# Altium project GameBoard_V1I1.PrjPcb (part 18 of 20)

## Sheet [28] - PWR 1V375 OPT, 3V3 OPT.SchDoc
size A2; DocumentNumber: 27; SheetNumber: 27; SheetTotal: 32
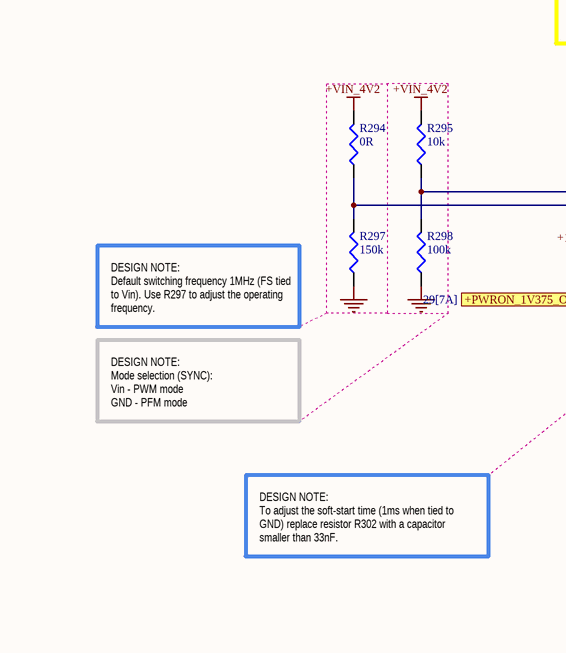
[diagram p88: [28] - PWR 1V375 OPT, 3V3 OPT.SchDoc, top left]
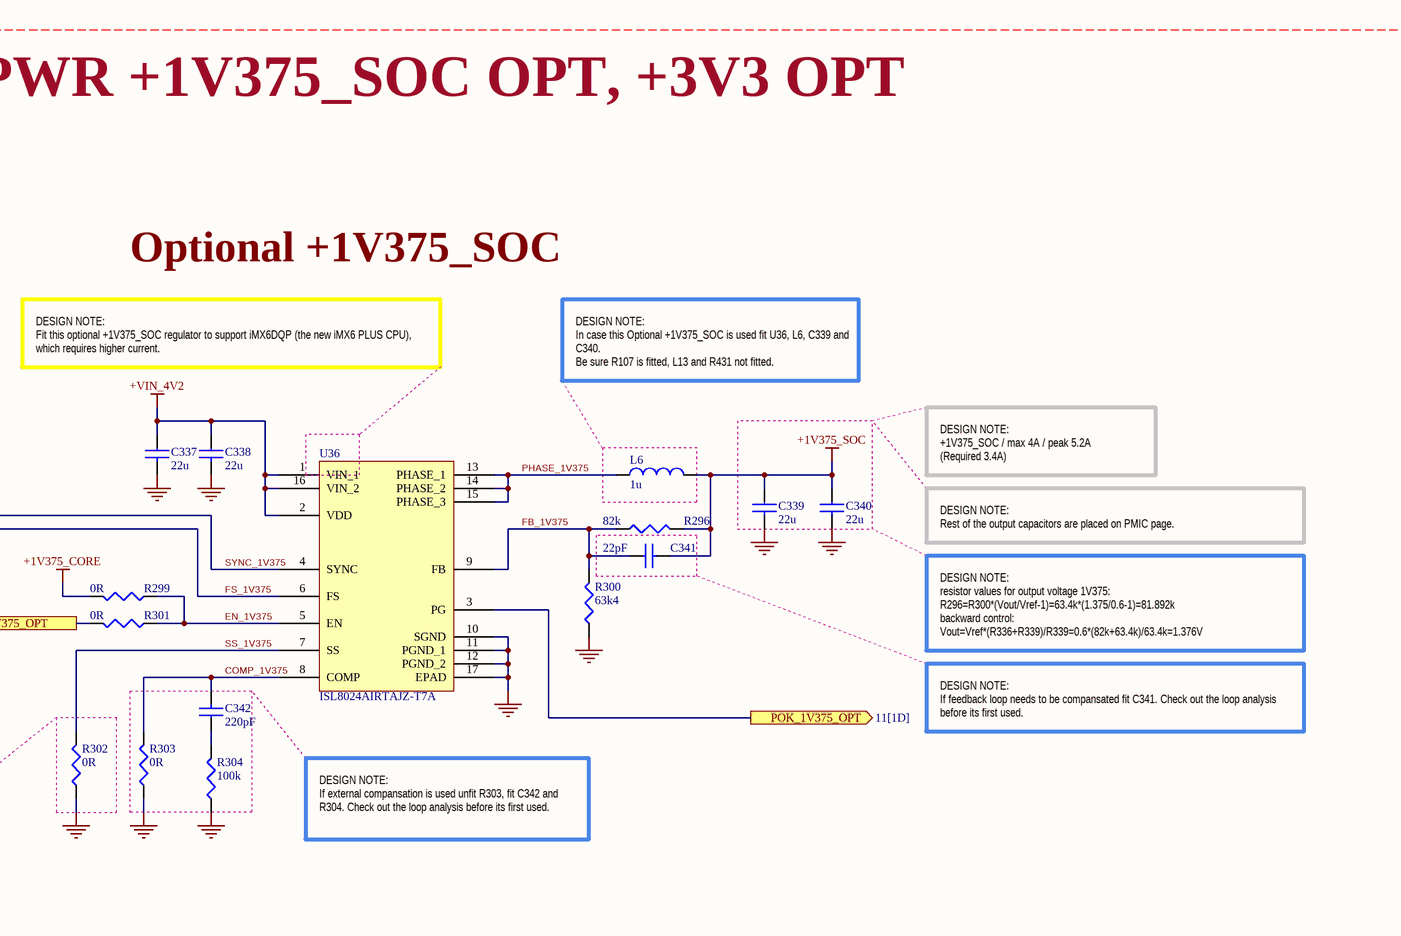
[diagram p89: [28] - PWR 1V375 OPT, 3V3 OPT.SchDoc, top right]
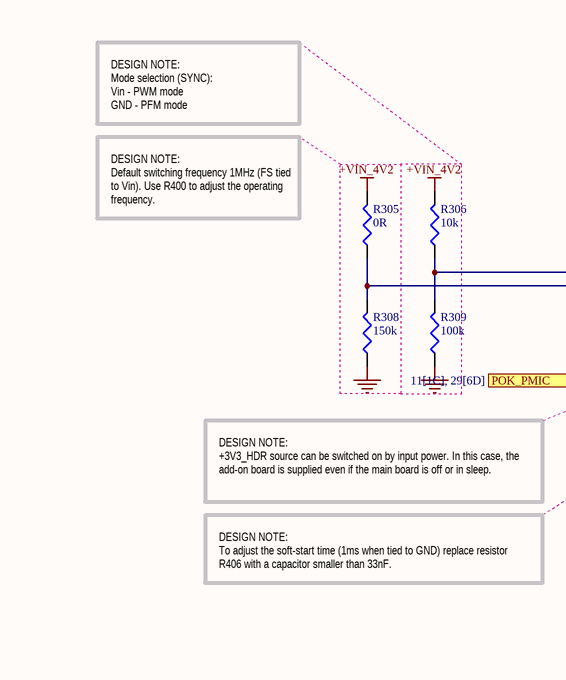
[diagram p90: [28] - PWR 1V375 OPT, 3V3 OPT.SchDoc, bottom left]
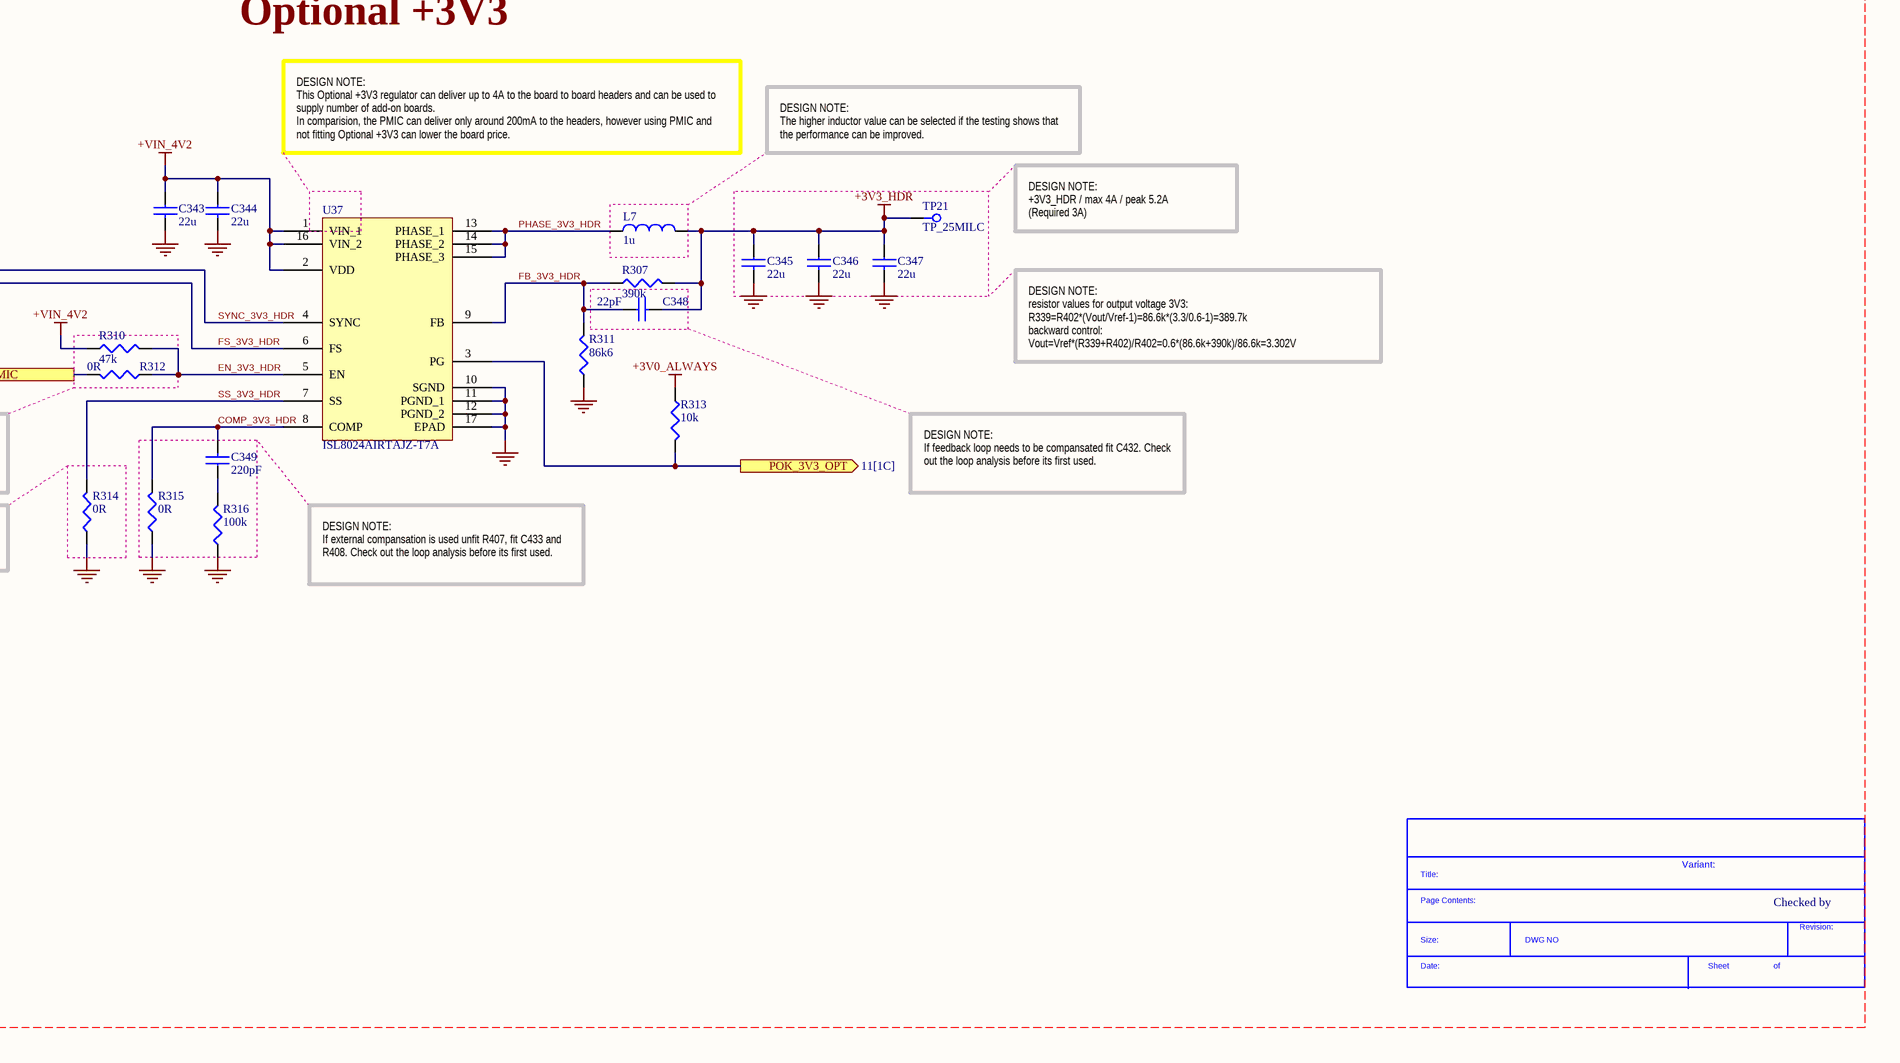
[diagram p91: [28] - PWR 1V375 OPT, 3V3 OPT.SchDoc, bottom right]

### Parts
(Parts that share a designator on the sheet are numbered #1, #2 ... from top to bottom, then left to right.)
*#32  SDTitleBlock  (value not drawn)  (graphical)
C337  22u  [C0603]
C338  22u  [C0603]
C339  22u  [C0603]
C340  22u  [C0603]
C341  22pF  [C0402]
C342  220pF  [C0402]
C343  22u  [C0603]
C344  22u  [C0603]
C345  22u  [C0603]
C346  22u  [C0603]
C347  22u  [C0603]
C348  22pF  [C0402]
C349  220pF  [C0402]
L6  1u  [IHLP_204MILX216MIL]
L7  1u  [IHLP_204MILX216MIL]
R294  0R  [R0402]
R295  10k  [R0402]
R296  82k  [R0402]
R297  150k  [R0402]
R298  100k  [R0402]
R299  0R  [R0402]
R300  63k4  [R0402]
R301  0R  [R0402]
R302  0R  [R0402]
R303  0R  [R0402]
R304  100k  [R0402]
R305  0R  [R0402]
R306  10k  [R0402]
R307  390k  [R0402]
R308  150k  [R0402]
R309  100k  [R0402]
R310  47k  [R0402]
R311  86k6  [R0402]
R312  0R  [R0402]
R313  10k  [R0402]
R314  0R  [R0402]
R315  0R  [R0402]
R316  100k  [R0402]
TP21  TP_25MILC  [TP_25C]  (no BOM)
U36  ISL8024AIRTAJZ-T7A  [16-TQFN_3mmx3mm_V1.1]
U37  ISL8024AIRTAJZ-T7A  [16-TQFN_3mmx3mm_V1.1]

### Ports
+PWRON_1V375_OPT (see 29[7A]), POK_1V375_OPT (out, see 11[1D]), POK_3V3_OPT (out, see 11[1C]), POK_PMIC (see 11[1C], 29[6D])

### Nets
+1V375_CORE: R299.2
+1V375_SOC: C339.1 C340.1 C341.2 L6.2 R296.2
+3V0_ALWAYS: R313.1
+3V3_HDR: C345.1 C346.1 C347.1 C348.2 L7.2 R307.2 TP21.1
+VIN_4V2: C337.1 C338.1 C343.1 C344.1 R294.2 R295.2 R305.2 R306.2 R310.1 U36.1(VIN_1) U36.2(VDD) U36.16(VIN_2) U37.1(VIN_1) U37.2(VDD) U37.16(VIN_2)
GND: C337.2 C338.2 C339.2 C340.2 C343.2 C344.2 C345.2 C346.2 C347.2 R297.1 R298.1 R300.1 R302.1 R303.1 R304.1 R308.1 R309.1 R311.1 R314.1 R315.1 R316.1 U36.10(SGND) U36.11(PGND_1) U36.12(PGND_2) U36.17(EPAD) U37.10(SGND) U37.11(PGND_1) U37.12(PGND_2) U37.17(EPAD)
+PWRON_1V375_OPT: R301.2 ; port +PWRON_1V375_OPT
COMP_1V375: C342.2 R303.2 U36.8(COMP)
COMP_3V3_HDR: C349.2 R315.2 U37.8(COMP)
EN_1V375: R299.1 R301.1 U36.5(EN)
EN_3V3_HDR: R310.2 R312.1 U37.5(EN)
FB_1V375: C341.1 R296.1 R300.2 U36.9(FB)
FB_3V3_HDR: C348.1 R307.1 R311.2 U37.9(FB)
FS_1V375: R294.1 R297.2 U36.6(FS)
FS_3V3_HDR: R305.1 R308.2 U37.6(FS)
PHASE_1V375: L6.1 U36.13(PHASE_1) U36.14(PHASE_2) U36.15(PHASE_3)
PHASE_3V3_HDR: L7.1 U37.13(PHASE_1) U37.14(PHASE_2) U37.15(PHASE_3)
POK_1V375_OPT: U36.3(PG) ; port POK_1V375_OPT
POK_3V3_OPT: R313.2 U37.3(PG) ; port POK_3V3_OPT
POK_PMIC: R312.2 ; port POK_PMIC
SS_1V375: R302.2 U36.7(SS)
SS_3V3_HDR: R314.2 U37.7(SS)
SYNC_1V375: R295.1 R298.2 U36.4(SYNC)
SYNC_3V3_HDR: R306.1 R309.2 U37.4(SYNC)
NetC342_1: C342.1 R304.2
NetC349_1: C349.1 R316.2

### Layout directives
net class [27] - PWR 1V375 OPT/3V3 OPT: +1V375_CORE, +1V375_SOC, +3V0_ALWAYS, +3V3_HDR, +VIN_4V2, COMP_1V375, COMP_3V3_HDR, EN_1V375, EN_3V3_HDR, FB_1V375, FB_3V3_HDR, FS_1V375, FS_3V3_HDR, GND, PHASE_1V375, PHASE_3V3_HDR, SS_1V375, SS_3V3_HDR, SYNC_1V375, SYNC_3V3_HDR

### Notes on the sheet
- PWR +1V375_SOC OPT, +3V3 OPT
- Optional +1V375_SOC
- DESIGN NOTE:
  Fit this optional +1V375_SOC regulator to support iMX6DQP (the new iMX6 PLUS CPU), which requires higher current.
- DESIGN NOTE:
  In case this Optional +1V375_SOC is used fit U36, L6, C339 and C340.
  Be sure R107 is fitted, L13 and R431 not fitted.
- DESIGN NOTE:
  +1V375_SOC / max 4A / peak 5.2A
  (Required 3.4A)
- DESIGN NOTE:
  Rest of the output capacitors are placed on PMIC page.
- DESIGN NOTE:
  Default switching frequency 1MHz (FS tied to Vin). Use R297 to adjust the operating frequency.
- DESIGN NOTE:
  resistor values for output voltage 1V375:
  R296=R300*(Vout/Vref-1)=63.4k*(1.375/0.6-1)=81.892k
  backward control:
  Vout=Vref*(R336+R339)/R339=0.6*(82k+63.4k)/63.4k=1.376V
- DESIGN NOTE:
  Mode selection (SYNC):
  Vin - PWM mode
  GND - PFM mode
- DESIGN NOTE:
  If feedback loop needs to be compansated fit C341. Check out the loop analysis before its first used.
- DESIGN NOTE:
  If external compansation is used unfit R303, fit C342 and R304. Check out the loop analysis before its first used.
- DESIGN NOTE:
  To adjust the soft-start time (1ms when tied to GND) replace resistor R302 with a capacitor smaller than 33nF.
- Optional +3V3
- DESIGN NOTE:
  This Optional +3V3 regulator can deliver up to 4A to the board to board headers and can be used to supply number of add-on boards.
  In comparision, the PMIC can deliver only around 200mA to the headers, however using PMIC and not fitting Optional +3V3 can lower the board price.
- DESIGN NOTE:
  The higher inductor value can be selected if the testing shows that the performance can be improved.
- DESIGN NOTE:
  Default switching frequency 1MHz (FS tied to Vin). Use R400 to adjust the operating frequency.
- DESIGN NOTE:
  +3V3_HDR / max 4A / peak 5.2A
  (Required 3A)
- DESIGN NOTE:
  resistor values for output voltage 3V3:
  R339=R402*(Vout/Vref-1)=86.6k*(3.3/0.6-1)=389.7k
  backward control:
  Vout=Vref*(R339+R402)/R402=0.6*(86.6k+390k)/86.6k=3.302V
- DESIGN NOTE:
  +3V3_HDR source can be switched on by input power. In this case, the add-on board is supplied even if the main board is off or in sleep.
- DESIGN NOTE:
  If feedback loop needs to be compansated fit C432. Check out the loop analysis before its first used.
- DESIGN NOTE:
  To adjust the soft-start time (1ms when tied to GND) replace resistor R406 with a capacitor smaller than 33nF.
- DESIGN NOTE:
  If external compansation is used unfit R407, fit C433 and R408. Check out the loop analysis before its first used.
- Variant:
- Checked by
- (in symbol SDTitleBlock) Title:; Page Contents:; Revision:; Size:; DWG NO; Date:; Sheet; of

### Library data of the parts
C337 C338 C343 C344 = C1608X5R0J226M080AC: CAP CER 22UF 6.3V 20% X5R 0603; Manufacturer: TDK Corporation; Capacitance: 22µF; .Creator: MM; .Checked PCB: used; Supplier 1: Digi-Key; Manufacturer Part Number: C1608X5R0J226M080AC; RoHS: RoHS Compliant; Category: Capacitors; Stock 1: 593047; Pricing 1: 1=0.39, 10=0.343, 100=0.1714, 250=0.13708, 500=0.12484, 1000=0.1104 (USD); Packaging: Cut Tape (CT); Tolerance: ±20%; Voltage - Rated: 6.3V; Temperature Coefficient: X5R; Mounting Type: Surface Mount, MLCC; Operating Temperature: -55°C ~ 85°C; Applications: General Purpose; Ratings: -; Package / Case: 0603 (1608 Metric); Size / Dimension: 0.063" L x 0.031" W (1.60mm x 0.80mm); Height - Seated (Max): -; Thickness (Max): 0.039" (1.00mm); Lead Spacing: -; Features: -; Lead Style: -; ComponentLink1URL: http://product.tdk.com/en/catalog/datasheets/mlcc_commercial_general_en.pdf; ComponentLink1Description: http://product.tdk.com/en/catalog/datasheets/mlcc_commercial_general_en.pdf; Supplier Part Number 1: 445-8028-1-ND; .Checked SCH: used
C339 C340 C345-C347 = GRM188R60G226MEA0L: CAP CER 22UF 4V 20% X5R 0603; Manufacturer: Murata Electronics North America; Capacitance: 22µF; .Checked PCB: used; .Creator: MM; Supplier 1: Digi-Key; Supplier Part Number 1: 490-5526-1-ND; Manufacturer Part Number: GRM188R60G226MEA0L; RoHS: RoHS Compliant; Category: Capacitors; Stock 1: 5760; Pricing 1: 1=0.79, 10=0.663, 50=0.4752, 100=0.4158, 250=0.32672, 500=0.297, 1000=0.2376 (USD); Voltage - Rated: 4V; Tolerance: ±20%; Temperature Coefficient: X5R; Mounting Type: Surface Mount, MLCC; Operating Temperature: -55°C ~ 85°C; Applications: General Purpose; Ratings: -; Package / Case: 0603 (1608 Metric); Size / Dimension: 0.063" L x 0.031" W (1.60mm x 0.80mm); Height - Seated (Max): -; Thickness (Max): 0.035" (0.90mm); Lead Spacing: -; Features: -; Packaging: Cut Tape (CT); Lead Style: -; ComponentLink1URL: http://www.murata.com/products/catalog/pdf/c02e.pdf; ComponentLink1Description: http://www.murata.com/products/catalog/pdf/c02e.pdf; .Checked SCH: used
C341 C348 = C1005C0G1H220J: CAP CER 22PF 50V C0G 5% 0402; Manufacturer: TDK Corporation; .Checked PCB: used; Temperature Coefficient: C0G, NP0; Capacitance: 22pF; Category: Capacitors; Supplier Part Number: 445-1239-1-ND; Manufacturer Part Number: C1005C0G1H220J; Operating Temperature: -55°C ~ 125°C; Package / Case: 0402 (1005 Metric); Price 1k [$]: 0.00442; Value: 22pF; .Checked SCH: used; Voltage - Rated: 50V; Supplier: Digikey; Supplier 1: Digi-Key; Supplier Part Number 1: 445-1239-1-ND; RoHS: RoHS Compliant; Stock 1: 176261; Pricing 1: 1=0.08, 10=0.05, 100=0.018, 250=0.013, 500=0.0096, 1000=0.0065 (USD); Tolerance: ±5%; Mounting Type: Surface Mount, MLCC; Applications: General Purpose; Ratings: -; Size / Dimension: 0.039" L x 0.020" W (1.00mm x 0.50mm); Height - Seated (Max): -; Thickness (Max): 0.022" (0.55mm); Lead Spacing: -; Features: -; Packaging: Cut Tape (CT); Lead Style: -; ComponentLink1URL: http://www.tdk.co.jp/tefe02/e412_c.pdf; ComponentLink1Description: http://www.tdk.co.jp/tefe02/e412_c.pdf
C342 C349 = C1005X7R1H221K: CAP CER 220PF 50V X7R 10% 0402; Manufacturer: TDK Corporation; .Checked PCB: used; Capacitance: 220pF; Category: Capacitors; Supplier Part Number: 445-1254-1-ND; Manufacturer Part Number: C1005X7R1H221K; Operating Temperature: -55°C ~ 125°C; Package / Case: 0402 (1005 Metric); Price 1k [$]: 0.00650; Value: 220pF; .Checked SCH: used; Voltage - Rated: 50V; Supplier: Digikey; Supplier 1: Digi-Key; Supplier Part Number 1: 445-1254-1-ND; RoHS: RoHS Compliant; Stock 1: 212041; Pricing 1: 1=0.08, 10=0.05, 100=0.018, 250=0.013, 500=0.0096, 1000=0.0065 (USD); Tolerance: ±10%; Temperature Coefficient: X7R; Mounting Type: Surface Mount, MLCC; Applications: General Purpose; Ratings: -; Size / Dimension: 0.039" L x 0.020" W (1.00mm x 0.50mm); Height - Seated (Max): -; Thickness (Max): 0.022" (0.55mm); Lead Spacing: -; Features: -; Packaging: Cut Tape (CT); Lead Style: -; ComponentLink1URL: http://www.tdk.co.jp/tefe02/e412_c.pdf; ComponentLink1Description: http://www.tdk.co.jp/tefe02/e412_c.pdf; Supplier 2: Digi-Key; Supplier Part Number 2: 399-14273-1-ND
L6 L7 = IHLP2020BZER1R0M11: as L17 on sheet [31] - PWR BATTERY CHARGER; Supplier 1: Digi-Key; Manufacturer Part Number: IHLP2020BZER1R0M11; RoHS: RoHS Compliant; Category: Inductors, Coils, Chokes; Stock 1: 8442; Pricing 1: 1=2.4, 10=2.24, 100=1.664, 500=1.408, 1000=1.312 (USD); Packaging: Cut Tape (CT); Material - Core: -; Current Rating: 7.5A; Q @ Freq: -; Operating Temperature: -55°C ~ 125°C; Mounting Type: Surface Mount; Package / Case: Non Standard; Size / Dimension: 0.216" L x 0.204" W (5.49mm x 5.18mm); Height - Seated (Max): 0.079" (2.00mm); Supplier Device Package: -; Supplier Part Number 1: 541-1218-1-ND; .Checked SCH: used
R294 R299 R301-R303 R305 R312 R314 R315 = RC0402JR-070RL: as R465-R469 on sheet [31] - PWR BATTERY CHARGER; Category: Resistors; Supplier Part Number: 311-0.0JRCT-ND; Manufacturer Part Number: RC0402JR-070RL; Package / Case: 0402 (1005 Metric); Price 1k [$]: 0.01389; Value: 0R; .Checked SCH: used; Supplier: Digikey; Supplier 1: Digi-Key; Supplier Part Number 1: 311-0.0JRCT-ND; RoHS: RoHS Compliant; Stock 1: 1106330; Pricing 1: 10=0.012, 50=0.009, 100=0.0069, 250=0.00512, 500=0.0038, 1000=0.00253 (USD); Composition: Thick Film; Features: -; Temperature Coefficient: -; Size / Dimension: 0.039" L x 0.020" W (1.00mm x 0.50mm); Height: 0.016" (0.40mm); Number of Terminations: 2; Packaging: Cut Tape (CT); ComponentLink1URL: http://www.yageo.com/documents/recent/PYu-RC0402_51_RoHS_L_6.pdf; ComponentLink1Description: http://www.yageo.com/documents/recent/PYu-RC0402_51_RoHS_L_6.pdf
R295 R306 R313 = RC0402FR-0710KL: as R478 on sheet [31] - PWR BATTERY CHARGER; Category: Resistors; Supplier Part Number: 311-10.0KLRCT-ND; Manufacturer Part Number: RC0402FR-0710KL; Package / Case: 0402 (1005 Metric); Price 1k [$]: 0.01421; Resistance (Ohms): 10K; Tolerance: ±1%; Value: 10k; .Checked SCH: used; Supplier: Digikey; Supplier 1: Digi-Key; Supplier Part Number 1: 311-10.0KLRCT-ND; RoHS: RoHS Compliant; Stock 1: 2916495; Pricing 1: 10=0.014, 50=0.0104, 100=0.0079, 250=0.00584, 500=0.00432, 1000=0.00288 (USD); Composition: Thick Film; Features: -; Size / Dimension: 0.039" L x 0.020" W (1.00mm x 0.50mm); Height: 0.016" (0.40mm); Number of Terminations: 2; Packaging: Cut Tape (CT); ComponentLink1URL: http://www.yageo.com/documents/recent/PYu-RC0402_51_RoHS_L_6.pdf; ComponentLink1Description: http://www.yageo.com/documents/recent/PYu-RC0402_51_RoHS_L_6.pdf
R296 = RC0402FR-0782KL: RES 82.0K OHM 1/16W 1% 0402 SMD; Manufacturer: Yageo; Power (Watts): 0.063W, 1/16W; Temperature Coefficient: ±100ppm/°C; .Creator: MM; .Checked PCB: used; Supplier 1: Digi-Key; Manufacturer Part Number: RC0402FR-0782KL; RoHS: RoHS Compliant; Category: Resistors; Stock 1: 338; Pricing 1: 1=0.1, 10=0.015, 25=0.0108, 100=0.006, 250=0.00456, 500=0.00364, 1000=0.00268, 2500=0.00233, 5000=0.00192 (USD); Packaging: Cut Tape (CT); Resistance (Ohms): 82k; Tolerance: ±1%; Composition: Thick Film; Features: Moisture Resistant; Package / Case: 0402 (1005 Metric); Supplier Device Package: 0402; Size / Dimension: 0.039" L x 0.020" W (1.00mm x 0.50mm); Height: 0.016" (0.40mm); Number of Terminations: 2; ComponentLink1URL: http://www.yageo.com/documents/recent/PYu-RC0402_51_RoHS_L_6.pdf; ComponentLink1Description: http://www.yageo.com/documents/recent/PYu-RC0402_51_RoHS_L_6.pdf; Supplier Part Number 1: 311-82.0KLRCT-ND; .Checked SCH: used
R297 R308 = RC0402FR-07150KL: RES 150K OHM 1/16W 1% 0402 SMD; Manufacturer: Yageo; Power (Watts): 0.063W, 1/16W; Temperature Coefficient: ±100ppm/°C; .Creator: MM; .Checked PCB: used; Supplier 1: Digi-Key; Manufacturer Part Number: RC0402FR-07150KL; RoHS: RoHS Compliant; Category: Resistors; Stock 1: 612629; Pricing 1: 1=0.1, 10=0.015, 25=0.0108, 100=0.006, 250=0.00456, 500=0.00364, 1000=0.00268, 2500=0.00233, 5000=0.00192 (USD); Packaging: Cut Tape (CT); Resistance (Ohms): 150k; Tolerance: ±1%; Composition: Thick Film; Features: Moisture Resistant; Package / Case: 0402 (1005 Metric); Supplier Device Package: 0402; Size / Dimension: 0.039" L x 0.020" W (1.00mm x 0.50mm); Height: 0.016" (0.40mm); Number of Terminations: 2; ComponentLink1URL: http://www.yageo.com/documents/recent/PYu-RC0402_51_RoHS_L_6.pdf; ComponentLink1Description: http://www.yageo.com/documents/recent/PYu-RC0402_51_RoHS_L_6.pdf; Supplier Part Number 1: 311-150KLRCT-ND; .Checked SCH: used
R298 R304 R309 R316 = RMCF0402FT100K: RES 100K OHM 1/16W 1% 0402 SMD; Manufacturer: Stackpole Electronics Inc; Power (Watts): 0.063W, 1/16W; .Checked PCB: used; Temperature Coefficient: ±100ppm/°C; Category: Resistors; Supplier Part Number: RMCF0402FT100KCT-ND; Manufacturer Part Number: RMCF0402FT100K; Package / Case: 0402 (1005 Metric); Price 1k [$]: 0.00384; Resistance (Ohms): 100K; Tolerance: ±1%; Value: 100k; .Checked SCH: used; Supplier: Digikey; Supplier 1: Digi-Key; Supplier Part Number 1: YAG1343DKR-ND; RoHS: RoHS Compliant; Composition: Thick Film; Features: -; Size / Dimension: 0.039" L x 0.020" W (1.00mm x 0.50mm); Height: 0.016" (0.40mm); Number of Terminations: 2; Packaging: Cut Tape (CT); ComponentLink1URL: http://www.seielect.com/Catalog/SEI-RMCF.pdf; ComponentLink1Description: http://www.seielect.com/Catalog/SEI-RMCF.pdf
R300 = CRCW040263K4FKED: RES SMD 63.4K OHM 1% 1/16W 0402; Manufacturer: Vishay Dale; Power (Watts): 0.063W, 1/16W; Temperature Coefficient: ±100ppm/°C; .Checked PCB: used; .Creator: MM; Supplier 1: Digi-Key; Manufacturer Part Number: CRCW040263K4FKED; RoHS: RoHS Compliant; Category: Resistors; Stock 1: 43534; Pricing 1: 10=0.083, 50=0.0444, 200=0.0255, 1000=0.0174 (USD); Packaging: Cut Tape (CT); Resistance (Ohms): 63.4k; Tolerance: ±1%; Composition: Thick Film; Features: Automotive AEC-Q200; Operating Temperature: -55°C ~ 155°C; Package / Case: 0402 (1005 Metric); Supplier Device Package: 0402 (1005 Metric); Size / Dimension: 0.039" L x 0.020" W (1.00mm x 0.50mm); Height: 0.016" (0.40mm); Number of Terminations: 2; ComponentLink1URL: http://www.vishay.com/docs/20035/dcrcwe3.pdf; ComponentLink1Description: http://www.vishay.com/docs/20035/dcrcwe3.pdf; Supplier Part Number 1: 541-63.4KLCT-ND; .Checked SCH: used; Supplier 2: Digi-Key; Supplier Part Number 2: P63.4KDCCT-ND
R307 = CRCW0402390KFKED: RES 390K OHM 1/16W 1% 0402 SMD; Manufacturer: Vishay Dale; Power (Watts): 0.063W, 1/16W; Temperature Coefficient: ±100ppm/°C; .Creator: MM; .Checked SCH: used; Supplier 1: Digi-Key; Manufacturer Part Number: CRCW0402390KFKED; RoHS: RoHS Compliant; Category: Resistors; Stock 1: 288225; Pricing 1: 10=0.083, 50=0.0444, 200=0.0255, 1000=0.0174 (USD); Packaging: Cut Tape (CT); Resistance (Ohms): 390k; Tolerance: ±1%; Composition: Thick Film; Features: Automotive AEC-Q200 Qualified; Package / Case: 0402 (1005 Metric); Supplier Device Package: 0402 (1005 Metric); Size / Dimension: 0.039" L x 0.020" W (1.00mm x 0.50mm); Height: 0.016" (0.40mm); Number of Terminations: 2; ComponentLink1URL: http://www.vishay.com/docs/20035/dcrcwe3.pdf; ComponentLink1Description: http://www.vishay.com/docs/20035/dcrcwe3.pdf; Supplier Part Number 1: 541-390KLCT-ND; .Checked PCB: used; Supplier 2: Digi-Key; Supplier Part Number 2: YAG3143CT-ND
R310 = RC0402FR-0747KL: RES 47.0K OHM 1/16W 1% 0402 SMD; Manufacturer: Yageo; Power (Watts): 0.063W, 1/16W; .Checked PCB: used; Temperature Coefficient: ±100ppm/°C; Category: Resistors; Supplier Part Number: 311-47.0KLRCT-ND; Manufacturer Part Number: RC0402FR-0747KL; Package / Case: 0402 (1005 Metric); Price 1k [$]: 0.01421; Resistance (Ohms): 47K; Tolerance: ±1%; Value: 47k; .Checked SCH: used; Supplier: Digikey; Supplier 1: Digi-Key; Supplier Part Number 1: 311-47.0KLRCT-ND; RoHS: RoHS Compliant; Stock 1: 1227580; Pricing 1: 10=0.014, 50=0.0104, 100=0.0079, 250=0.00584, 500=0.00432, 1000=0.00288 (USD); Composition: Thick Film; Features: -; Size / Dimension: 0.039" L x 0.020" W (1.00mm x 0.50mm); Height: 0.016" (0.40mm); Number of Terminations: 2; Packaging: Cut Tape (CT); ComponentLink1URL: http://www.yageo.com/documents/recent/PYu-RC0402_51_RoHS_L_6.pdf; ComponentLink1Description: http://www.yageo.com/documents/recent/PYu-RC0402_51_RoHS_L_6.pdf; Supplier 2: Digi-Key; Supplier Part Number 2: 1276-3467-1-ND
R311 = RC0402FR-0786K6L: RES SMD 86.6K OHM 1% 1/16W 0402; Manufacturer: Yageo; Power (Watts): 0.063W, 1/16W; Temperature Coefficient: ±100ppm/°C; .Creator: MM; .Checked PCB: used; Supplier 1: Digi-Key; Manufacturer Part Number: RC0402FR-0786K6L; RoHS: RoHS Compliant; Category: Resistors; Stock 1: 7980; Pricing 1: 1=0.1, 10=0.012, 25=0.0084, 100=0.0048, 250=0.00368, 500=0.00294, 1000=0.00216, 2500=0.00187, 5000=0.00155 (USD); Packaging: Cut Tape (CT); Resistance (Ohms): 86.6k; Tolerance: ±1%; Composition: Thick Film; Features: Moisture Resistant; Operating Temperature: -55°C ~ 155°C; Package / Case: 0402 (1005 Metric); Supplier Device Package: 0402; Size / Dimension: 0.040" L x 0.020" W (1.00mm x 0.50mm); Height: 0.016" (0.40mm); Number of Terminations: 2; ComponentLink1URL: http://www.yageo.com/NewPortal/yageodocoutput?fileName=/pdf/R-Chip/PYu-RC_Group_51_RoHS_L_3.pdf; ComponentLink1Description: http://www.yageo.com/NewPortal/yageodocoutput?fileName=/pdf/R-Chip/PYu-RC_Group_51_RoHS_L_3.pdf; Supplier Part Number 1: YAG3249CT-ND; .Checked SCH: used
TP21 = TP_25MILC: Test Point 25mil; .Checked PCB: used
U36 U37 = ISL8024AIRTAJZ-T7A: IC REG BUCK SYNC ADJ 4A 16TQFN; Manufacturer: Intersil; Output Type: Adjustable; Number of Outputs: 1; Voltage - Output: 0.6 V ~ 5.5 V; Voltage - Input: 2.7 V ~ 5.5 V; Frequency - Switching: 490kHz ~ 4.2MHz; Synchronous Rectifier: Yes; .Creator: MM; .Checked PCB: used; Supplier 1: Digi-Key; Manufacturer Part Number: ISL8024AIRTAJZ-T7A; RoHS: RoHS Compliant; Category: Integrated Circuits (ICs); Stock 1: 440; Pricing 1: 1=4.61, 25=3.63, 100=3.08 (USD); Packaging: Cut Tape (CT); Type: Step-Down (Buck); Current - Output: 4A; Operating Temperature: -40°C ~ 85°C; Mounting Type: Surface Mount; Package / Case: 16-WFQFN Exposed Pad; Supplier Device Package: 16-TQFN (3x3); ComponentLink1URL: http://www.intersil.com/content/dam/Intersil/documents/fn78/fn7812.pdf; ComponentLink1Description: http://www.intersil.com/content/dam/Intersil/documents/fn78/fn7812.pdf; Supplier Part Number 1: ISL8024AIRTAJZ-T7ACT-ND; .Checked SCH: used

## Sheet [26] - BLE, WIFI.SchDoc
size A2; DocumentNumber: 25; SheetNumber: 25; SheetTotal: 32
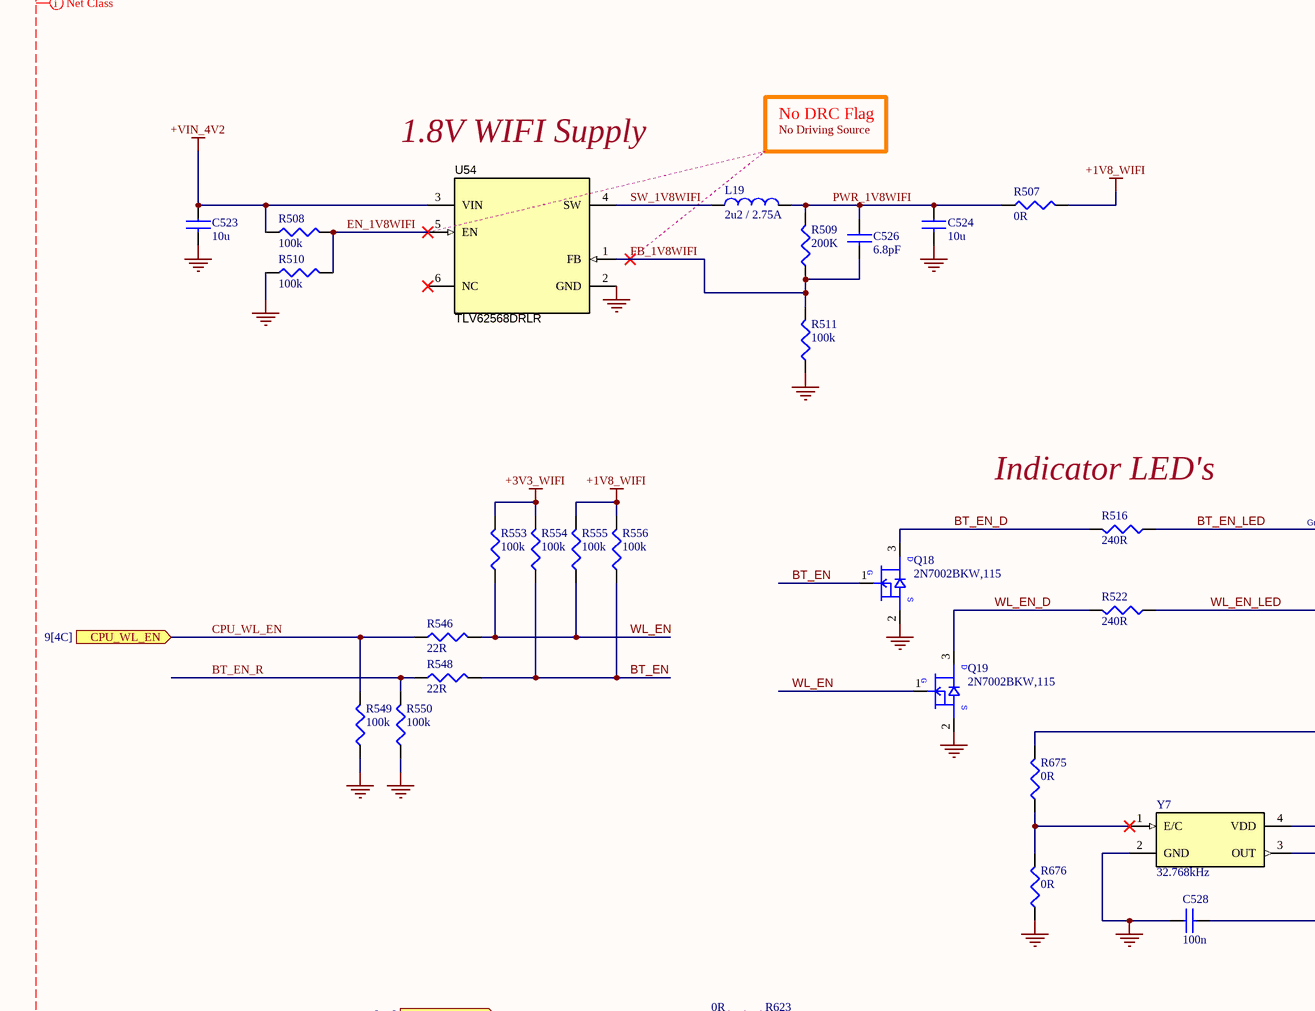
[diagram p92: [26] - BLE, WIFI.SchDoc, top left]
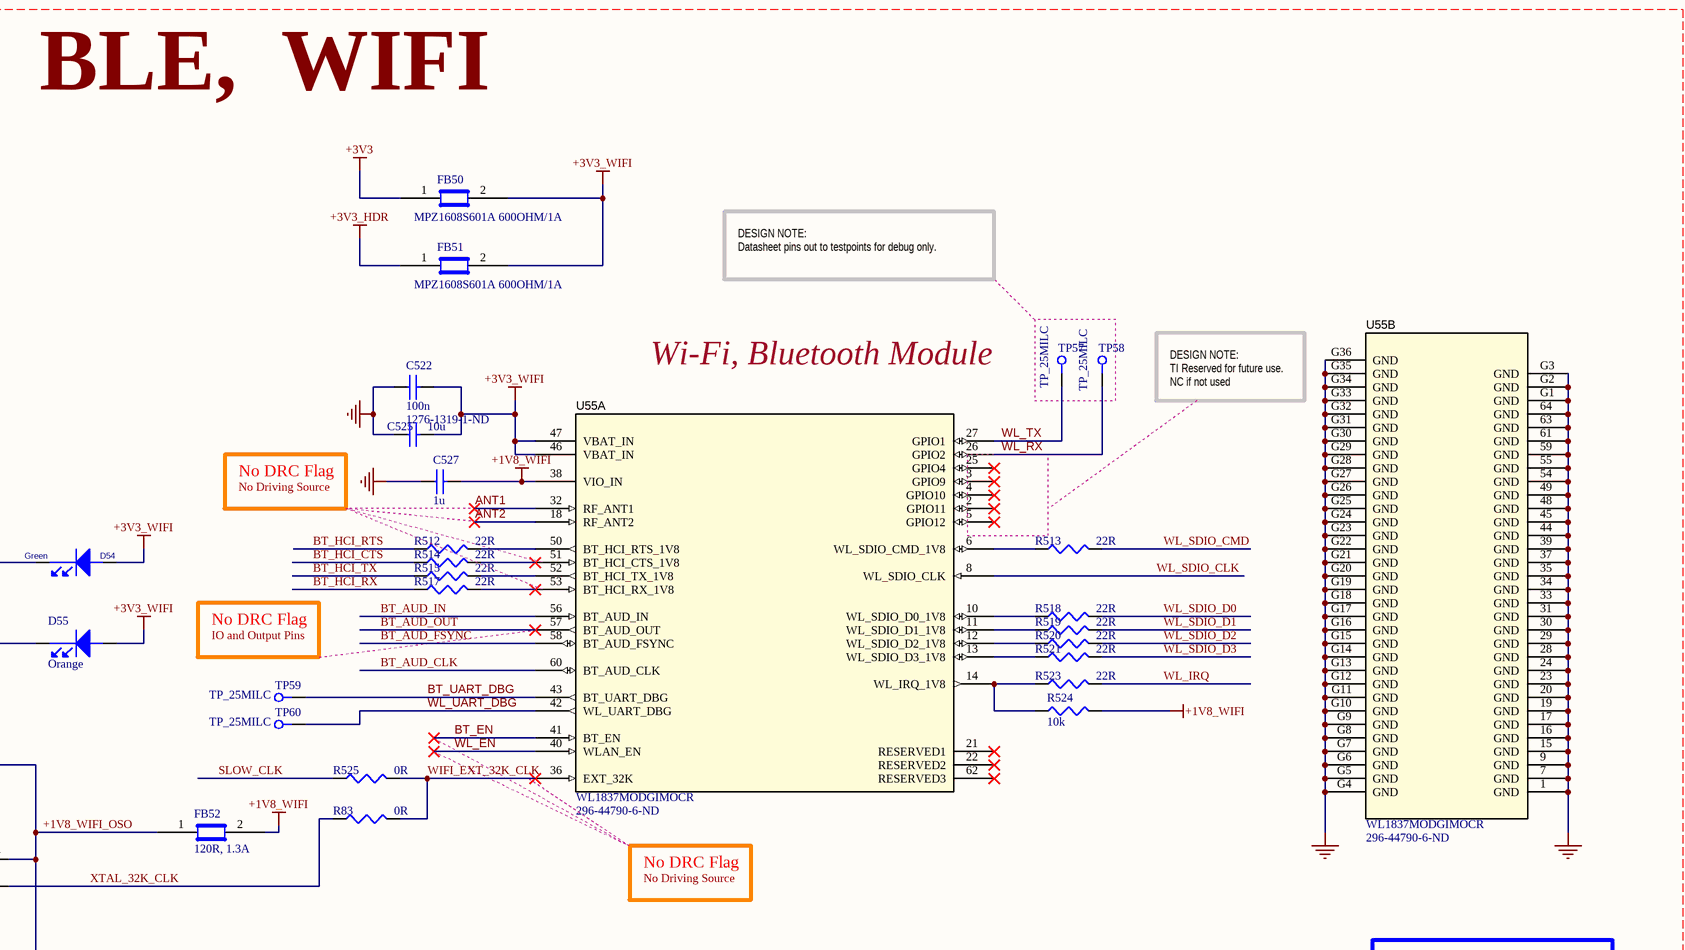
[diagram p93: [26] - BLE, WIFI.SchDoc, top right]
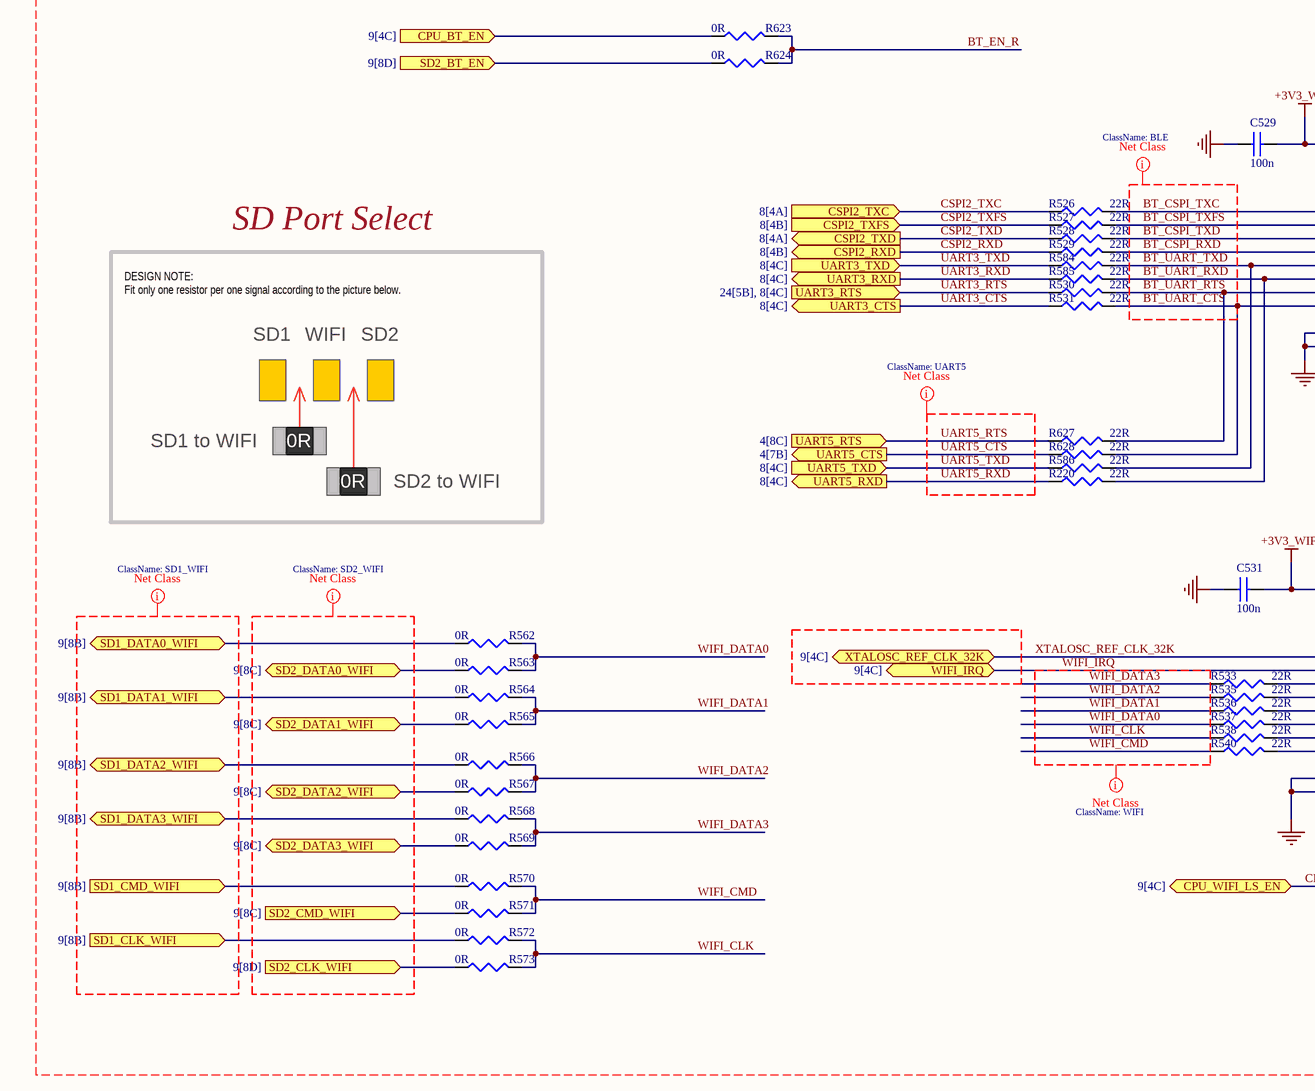
[diagram p94: [26] - BLE, WIFI.SchDoc, bottom left]
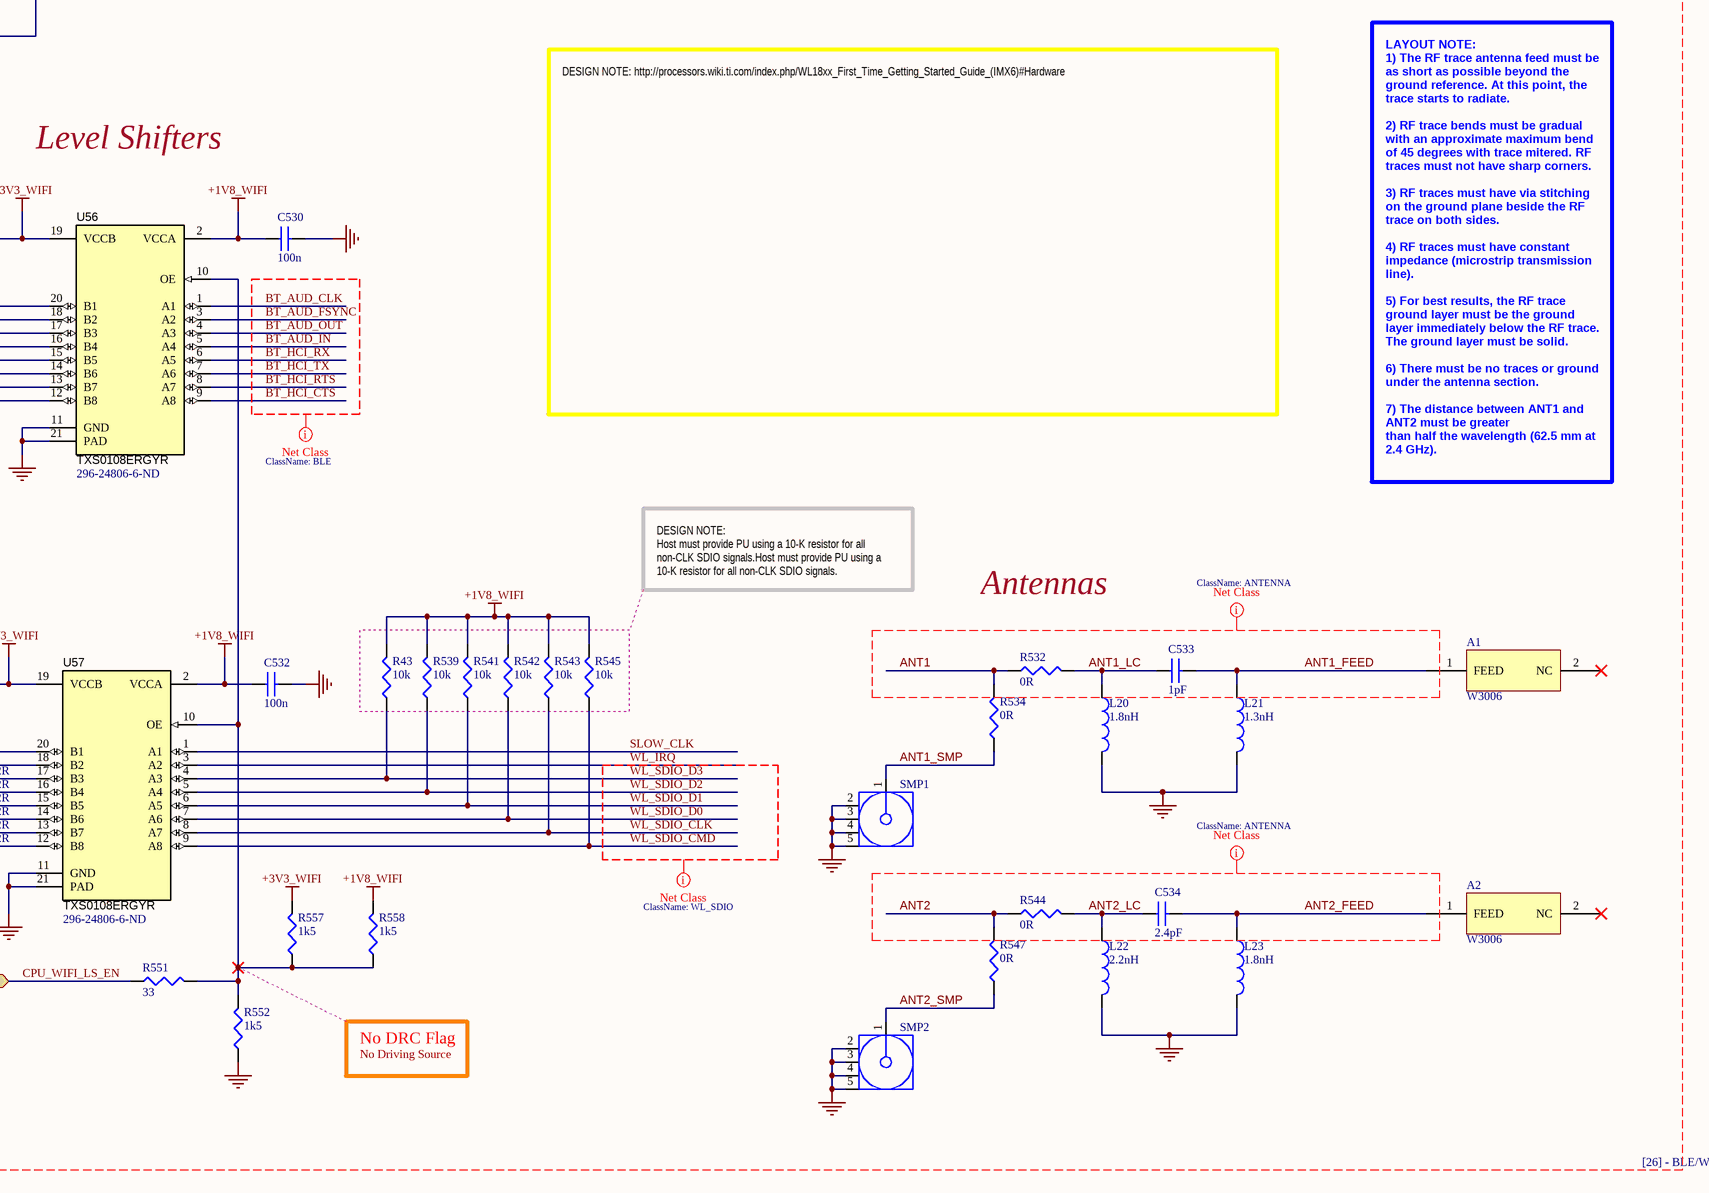
[diagram p95: [26] - BLE, WIFI.SchDoc, bottom right]

### Parts
A1  W3006  [W3006]
A2  W3006  [W3006]
C522  100n  Supplier Part Number 2: 1276-1319-1-ND  [C0201]
C523  10u  [C0603]
C524  10u  [C0603]
C525  10u  [C0603]
C526  6.8pF  [C0201]
C527  1u  [C0402]
C528  100n  [C0402]
C529  100n  [C0402]
C530  100n  [C0402]
C531  100n  [C0402]
C532  100n  [C0402]
C533  1pF  [C0402]
C534  2.4pF  [c0402]
D54  Green  [LED_0603]
D55  Orange  [LED_0603]
FB50  MPZ1608S601A 600OHM/1A  [C0603]
FB51  MPZ1608S601A 600OHM/1A  [C0603]
FB52  120R, 1.3A  [C0402]
L19  2u2 / 2.75A  [IHLP_160MILX175MIL]
L20  1.8nH  [LQP_0402]
L21  1.3nH  [LQP_0402]
L22  2.2nH  [LQP_0402]
L23  1.8nH  [LQP_0402]
Q18  2N7002BKW,115  [SC70_SOT323]
Q19  2N7002BKW,115  [SC70_SOT323]
R43  10k  [R0201]
R83  0R  [R0402]
R220  22R  [R0402]
R507  0R  [R0805_small]
R508  100k  [R0402]
R509  200K  [R0402]
R510  100k  [R0402]
R511  100k  [R0402]
R512  22R  [R0402]
R513  22R  [R0402]
R514  22R  [R0402]
R515  22R  [R0402]
R516  240R  [R0402]
R517  22R  [R0402]
R518  22R  [R0402]
R519  22R  [R0402]
R520  22R  [R0402]
R521  22R  [R0402]
R522  240R  [R0402]
R523  22R  [R0402]
R524  10k  [R0402]
R525  0R  [R0402]
R526  22R  [R0402]
R527  22R  [R0402]
R528  22R  [R0402]
R529  22R  [R0402]
R530  22R  [R0402]
R531  22R  [R0402]
R532  0R  [R0402]
R533  22R  [R0402]
R534  0R  [R0402]
R535  22R  [R0402]
R536  22R  [R0402]
R537  22R  [R0402]
R538  22R  [R0402]
R539  10k  [R0201]
R540  22R  [R0402]
R541  10k  [R0201]
R542  10k  [R0201]
R543  10k  [R0201]
R544  0R  [R0402]
R545  10k  [R0201]
R546  22R  [R0402]
R547  0R  [R0402]
R548  22R  [R0402]
R549  100k  [R0402]
R550  100k  [R0402]
R551  33  [R0201]
R552  1k5  [R0402]
R553  100k  [R0402]
R554  100k  [R0402]
R555  100k  [R0402]
R556  100k  [R0402]
R557  1k5  [R0402]
R558  1k5  [R0402]
R562  0R  [R0402]
R563  0R  [R0402]
R564  0R  [R0402]
R565  0R  [R0402]
R566  0R  [R0402]
R567  0R  [R0402]
R568  0R  [R0402]
R569  0R  [R0402]
R570  0R  [R0402]
R571  0R  [R0402]
R572  0R  [R0402]
R573  0R  [R0402]
R584  22R  [R0402]
R585  22R  [R0402]
R586  22R  [R0402]
R623  0R  [R0402]
R624  0R  [R0402]
R627  22R  [R0402]
R628  22R  [R0402]
R675  0R  [R0402]
R676  0R  [R0402]
SMP1  Coax Conn  [SMP-F]  (value not drawn)
SMP2  Coax Conn  [SMP-F]  (value not drawn)
TP57  TP_25MILC  [TP_25C]  (no BOM)
TP58  TP_25MILC  [TP_25C]  (no BOM)
TP59  TP_25MILC  [TP_25C]  (no BOM)
TP60  TP_25MILC  [TP_25C]  (no BOM)
U54  TLV62568DRLR  [DRL0006A]
U55  WL1837MODGIMOCR  Supplier Part Number 1: 296-44790-6-ND  [MOC0100A]  (parts A,B of 2)
U56  TXS0108ERGYR  Supplier Part Number 1: 296-24806-6-ND  [RGY0020A]
U57  TXS0108ERGYR  Supplier Part Number 1: 296-24806-6-ND  [RGY0020A]
Y7  32.768kHz  [ASDK2-32.768KHZ-LR-T3]

### Ports
CPU_BT_EN (in, see 9[4C]), CPU_WIFI_LS_EN (bidir, see 9[4C]), CPU_WL_EN (in, see 9[4C]), CSPI2_RXD (out, see 8[4B]), CSPI2_TXC (in, see 8[4A]), CSPI2_TXD (out, see 8[4A]), CSPI2_TXFS (in, see 8[4B]), SD1_CLK_WIFI (in, see 9[8B]), SD1_CMD_WIFI (in, see 9[8B]), SD1_DATA0_WIFI (bidir, see 9[8B]), SD1_DATA1_WIFI (bidir, see 9[8B]), SD1_DATA2_WIFI (bidir, see 9[8B]), SD1_DATA3_WIFI (bidir, see 9[8B]), SD2_BT_EN (in, see 9[8D]), SD2_CLK_WIFI (in, see 9[8D]), SD2_CMD_WIFI (in, see 9[8C]), SD2_DATA0_WIFI (bidir, see 9[8C]), SD2_DATA1_WIFI (bidir, see 9[8C]), SD2_DATA2_WIFI (bidir, see 9[8C]), SD2_DATA3_WIFI (bidir, see 9[8C]), UART3_CTS (out, see 8[4C]), UART3_RTS (in, see 24[5B], 8[4C]), UART3_RXD (out, see 8[4C]), UART3_TXD (in, see 8[4C]), UART5_CTS (out, see 4[7B]), UART5_RTS (in, see 4[8C]), UART5_RXD (out, see 8[4C]), UART5_TXD (in, see 8[4C]), WIFI_IRQ (bidir, see 9[4C]), XTALOSC_REF_CLK_32K (bidir, see 9[4C])

### Nets
+1V8_WIFI: C527.2 C530.1 C532.1 FB52.2 R43.2 R507.2 R524.2 R539.2 R541.2 R542.2 R543.2 R545.2 R555.2 R556.2 R558.2 U55.38(VIO_IN) U56.2(VCCA) U57.2(VCCA)
+3V3: FB50.1
+3V3_HDR: FB51.1
+3V3_WIFI: C522.2 C525.2 C529.2 C531.2 D54.2(ANODE) D55.2(ANODE) FB50.2 FB51.2 R553.2 R554.2 R557.2 U55.46(VBAT_IN) U55.47(VBAT_IN) U56.19(VCCB) U57.19(VCCB)
+VIN_4V2: C523.1 R508.1 U54.3(VIN)
GND: C522.1 C523.2 C524.2 C525.1 C527.1 C528.1 C529.1 C530.2 C531.1 C532.2 L20.2 L21.2 L22.2 L23.2 Q18.2(SOURCE) Q19.2(SOURCE) R510.1 R511.1 R549.1 R550.1 R552.1 R676.1 SMP1.2(GND) SMP1.3(GND) SMP1.4(GND) SMP1.5(GND) SMP2.2(GND) SMP2.3(GND) SMP2.4(GND) SMP2.5(GND) U54.2(GND) U55.1(GND) U55.7(GND) U55.9(GND) U55.15(GND) U55.16(GND) U55.17(GND) U55.19(GND) U55.20(GND) U55.23(GND) U55.24(GND) U55.28(GND) U55.29(GND) U55.30(GND) U55.31(GND) U55.33(GND) U55.34(GND) U55.35(GND) U55.37(GND) U55.39(GND) U55.44(GND) U55.45(GND) U55.48(GND) U55.49(GND) U55.54(GND) U55.55(GND) U55.59(GND) U55.61(GND) U55.63(GND) U55.64(GND) U55.G1(GND) U55.G2(GND) U55.G3(GND) U55.G4(GND) U55.G5(GND) U55.G6(GND) U55.G7(GND) U55.G8(GND) U55.G9(GND) U55.G10(GND) U55.G11(GND) U55.G12(GND) U55.G13(GND) U55.G14(GND) U55.G15(GND) U55.G16(GND) U55.G17(GND) U55.G18(GND) U55.G19(GND) U55.G20(GND) U55.G21(GND) U55.G22(GND) U55.G23(GND) U55.G24(GND) U55.G25(GND) U55.G26(GND) U55.G27(GND) U55.G28(GND) U55.G29(GND) U55.G30(GND) U55.G31(GND) U55.G32(GND) U55.G33(GND) U55.G34(GND) U55.G35(GND) U55.G36(GND) U56.11(GND) U56.21(PAD) U57.11(GND) U57.21(PAD) Y7.2(GND)
+1V8_WIFI_OSO: C528.2 FB52.1 R675.2 Y7.4(VDD)
ANT1: R532.1 R534.2 U55.32(RF_ANT1)
ANT1_FEED: A1.1(FEED) C533.2 L21.1
ANT1_LC: C533.1 L20.1 R532.2
ANT1_SMP: R534.1 SMP1.1(Signal)
ANT2: R544.1 R547.2 U55.18(RF_ANT2)
ANT2_FEED: A2.1(FEED) C534.2 L23.1
ANT2_LC: C534.1 L22.1 R544.2
ANT2_SMP: R547.1 SMP2.1(Signal)
BT_AUD_CLK: U55.60(BT_AUD_CLK) U56.1(A1)
BT_AUD_FSYNC: U55.58(BT_AUD_FSYNC) U56.3(A2)
BT_AUD_IN: U55.56(BT_AUD_IN) U56.5(A4)
BT_AUD_OUT: U55.57(BT_AUD_OUT) U56.4(A3)
BT_CSPI_RXD: R529.2 U56.16(B4)
BT_CSPI_TXC: R526.2 U56.20(B1)
BT_CSPI_TXD: R528.2 U56.17(B3)
BT_CSPI_TXFS: R527.2 U56.18(B2)
BT_EN: Q18.1(GATE) R548.2 R554.1 R556.1 U55.41(BT_EN)
BT_EN_D: Q18.3(DRAIN) R516.2
BT_EN_LED: D54.1(cathode) R516.1
BT_EN_R: R548.1 R550.2 R623.2 R624.2
BT_HCI_CTS: R514.1 U56.9(A8)
BT_HCI_RTS: R512.1 U56.8(A7)
BT_HCI_RX: R517.1 U56.6(A5)
BT_HCI_TX: R515.1 U56.7(A6)
BT_UART_CTS: R531.2 R628.2 U56.12(B8)
BT_UART_DBG: TP59.1 U55.43(BT_UART_DBG)
BT_UART_RTS: R530.2 R627.2 U56.13(B7)
BT_UART_RXD: R220.2 R585.2 U56.14(B6)
BT_UART_TXD: R584.2 R586.2 U56.15(B5)
CPU_BT_EN: R623.1 ; port CPU_BT_EN
CPU_WIFI_LS_EN: R551.1 ; port CPU_WIFI_LS_EN
CPU_WL_EN: R546.1 R549.2 ; port CPU_WL_EN
CSPI2_RXD: R529.1 ; port CSPI2_RXD
CSPI2_TXC: R526.1 ; port CSPI2_TXC
CSPI2_TXD: R528.1 ; port CSPI2_TXD
CSPI2_TXFS: R527.1 ; port CSPI2_TXFS
EN_1V8WIFI: R508.2 R510.2 U54.5(EN)
FB_1V8WIFI: C526.2 R509.1 R511.2 U54.1(FB)
PWR_1V8WIFI: C524.1 C526.1 L19.2 R507.1 R509.2
SD1_CLK_WIFI: R572.1 ; port SD1_CLK_WIFI
SD1_CMD_WIFI: R570.1 ; port SD1_CMD_WIFI
SD1_DATA0_WIFI: R562.1 ; port SD1_DATA0_WIFI
SD1_DATA1_WIFI: R564.1 ; port SD1_DATA1_WIFI
SD1_DATA2_WIFI: R566.1 ; port SD1_DATA2_WIFI
SD1_DATA3_WIFI: R568.1 ; port SD1_DATA3_WIFI
SD2_BT_EN: R624.1 ; port SD2_BT_EN
SD2_CLK_WIFI: R573.1 ; port SD2_CLK_WIFI
SD2_CMD_WIFI: R571.1 ; port SD2_CMD_WIFI
SD2_DATA0_WIFI: R563.1 ; port SD2_DATA0_WIFI
SD2_DATA1_WIFI: R565.1 ; port SD2_DATA1_WIFI
SD2_DATA2_WIFI: R567.1 ; port SD2_DATA2_WIFI
SD2_DATA3_WIFI: R569.1 ; port SD2_DATA3_WIFI
SLOW_CLK: R525.1 U57.1(A1)
SW_1V8WIFI: L19.1 U54.4(SW)
UART3_CTS: R531.1 ; port UART3_CTS
UART3_RTS: R530.1 ; port UART3_RTS
UART3_RXD: R585.1 ; port UART3_RXD
UART3_TXD: R584.1 ; port UART3_TXD
UART5_CTS: R628.1 ; port UART5_CTS
UART5_RTS: R627.1 ; port UART5_RTS
UART5_RXD: R220.1 ; port UART5_RXD
UART5_TXD: R586.1 ; port UART5_TXD
WIFI_CLK: R538.1 R572.2 R573.2
WIFI_CMD: R540.1 R570.2 R571.2
WIFI_DATA0: R537.1 R562.2 R563.2
WIFI_DATA1: R536.1 R564.2 R565.2
WIFI_DATA2: R535.1 R566.2 R567.2
WIFI_DATA3: R533.1 R568.2 R569.2
WIFI_EXT_32K_CLK: R83.2 R525.2 U55.36(EXT_32K)
WIFI_IRQ: U57.18(B2) ; port WIFI_IRQ
WL_EN: Q19.1(GATE) R546.2 R553.1 R555.1 U55.40(WLAN_EN)
WL_EN_D: Q19.3(DRAIN) R522.2
WL_EN_LED: D55.1(cathode) R522.1
WL_IRQ: R523.2 U57.3(A2)
WL_RX: TP58.1 U55.26(GPIO2)
WL_SDIO_CLK: R543.1 U55.8(WL_SDIO_CLK) U57.8(A7)
WL_SDIO_CMD: R513.2 R545.1 U57.9(A8)
WL_SDIO_D0: R518.2 R542.1 U57.7(A6)
WL_SDIO_D1: R519.2 R541.1 U57.6(A5)
WL_SDIO_D2: R520.2 R539.1 U57.5(A4)
WL_SDIO_D3: R43.1 R521.2 U57.4(A3)
WL_TX: TP57.1 U55.27(GPIO1)
WL_UART_DBG: TP60.1 U55.42(WL_UART_DBG)
XTAL_32K_CLK: R83.1 Y7.3(OUT)
XTALOSC_REF_CLK_32K: U57.20(B1) ; port XTALOSC_REF_CLK_32K
NetR512_2: R512.2 U55.50(BT_HCI_RTS_1V8)
NetR513_1: R513.1 U55.6(WL_SDIO_CMD_1V8)
NetR514_2: R514.2 U55.51(BT_HCI_CTS_1V8)
NetR515_2: R515.2 U55.52(BT_HCI_TX_1V8)
NetR517_2: R517.2 U55.53(BT_HCI_RX_1V8)
NetR518_1: R518.1 U55.10(WL_SDIO_D0_1V8)
NetR519_1: R519.1 U55.11(WL_SDIO_D1_1V8)
NetR520_1: R520.1 U55.12(WL_SDIO_D2_1V8)
NetR521_1: R521.1 U55.13(WL_SDIO_D3_1V8)
NetR523_1: R523.1 R524.1 U55.14(WL_IRQ_1V8)
NetR533_2: R533.2 U57.17(B3)
NetR535_2: R535.2 U57.16(B4)
NetR536_2: R536.2 U57.15(B5)
NetR537_2: R537.2 U57.14(B6)
NetR538_2: R538.2 U57.13(B7)
NetR540_2: R540.2 U57.12(B8)
NetR551_2: R551.2 R552.2 R557.1 R558.1 U56.10(OE) U57.10(OE)
NetR675_1: R675.1 R676.2 Y7.1(E/C)

Not connected (* = marked no-connect by the designer): A1 2(NC)*; A2 2(NC)*; U54 6(NC)*; U55 2(GPIO11)* 3(GPIO9)* 4(GPIO10)* 5(GPIO12)* 21(RESERVED1)* 22(RESERVED2)* 25(GPIO4)* 62(RESERVED3)*

### Layout directives
net class [26] - BLE/WIFI: +1V8_WIFI, +1V8_WIFI_OSO, +3V3, +3V3_HDR, +3V3_WIFI, +VIN_4V2, ANT1, ANT1_FEED, ANT1_LC, ANT1_SMP, ANT2, ANT2_FEED, ANT2_LC, ANT2_SMP, BT_AUD_CLK, BT_AUD_FSYNC, BT_AUD_IN, BT_AUD_OUT, BT_CSPI_RXD, BT_CSPI_TXC, BT_CSPI_TXD, BT_CSPI_TXFS, BT_EN, BT_EN_D, BT_EN_LED, BT_EN_R, BT_HCI_CTS, BT_HCI_RTS, BT_HCI_RX, BT_HCI_TX, BT_UART_CTS, BT_UART_DBG, BT_UART_RTS, BT_UART_RXD, BT_UART_TXD, CPU_WIFI_LS_EN, CPU_WL_EN, CSPI2_RXD, CSPI2_TXC, CSPI2_TXD, CSPI2_TXFS, EN_1V8WIFI, FB_1V8WIFI, GND, PWR_1V8WIFI, SLOW_CLK, SW_1V8WIFI, UART3_CTS, UART3_RTS, UART3_RXD, UART3_TXD, UART5_CTS, UART5_RTS, UART5_RXD, UART5_TXD, WIFI_CLK, WIFI_CMD, WIFI_DATA0, WIFI_DATA1, WIFI_DATA2, WIFI_DATA3, WIFI_EXT_32K_CLK, WIFI_IRQ, WL_EN, WL_EN_D, WL_EN_LED, WL_IRQ, WL_RX, WL_SDIO_CLK, WL_SDIO_CMD, WL_SDIO_D0, WL_SDIO_D1, WL_SDIO_D2, WL_SDIO_D3, WL_TX, WL_UART_DBG, XTAL_32K_CLK, XTALOSC_REF_CLK_32K
net class WIFI: +1V8_WIFI, +1V8_WIFI_OSO, +3V3, +3V3_HDR, +3V3_WIFI, +VIN_4V2, ANT1, ANT1_FEED, ANT1_LC, ANT1_SMP, ANT2, ANT2_FEED, ANT2_LC, ANT2_SMP, BT_AUD_CLK, BT_AUD_FSYNC, BT_AUD_IN, BT_AUD_OUT, BT_CSPI_RXD, BT_CSPI_TXC, BT_CSPI_TXD, BT_CSPI_TXFS, BT_EN, BT_EN_D, BT_EN_LED, BT_EN_R, BT_HCI_CTS, BT_HCI_RTS, BT_HCI_RX, BT_HCI_TX, BT_UART_CTS, BT_UART_DBG, BT_UART_RTS, BT_UART_RXD, BT_UART_TXD, CPU_WIFI_LS_EN, CPU_WL_EN, CSPI2_RXD, CSPI2_TXC, CSPI2_TXD, CSPI2_TXFS, EN_1V8WIFI, FB_1V8WIFI, GND, PWR_1V8WIFI, SLOW_CLK, SW_1V8WIFI, UART3_CTS, UART3_RTS, UART3_RXD, UART3_TXD, UART5_CTS, UART5_RTS, UART5_RXD, UART5_TXD, WIFI_CLK, WIFI_CMD, WIFI_DATA0, WIFI_DATA1, WIFI_DATA2, WIFI_DATA3, WIFI_EXT_32K_CLK, WIFI_IRQ, WL_EN, WL_EN_D, WL_EN_LED, WL_IRQ, WL_RX, WL_SDIO_CLK, WL_SDIO_CMD, WL_SDIO_D0, WL_SDIO_D1, WL_SDIO_D2, WL_SDIO_D3, WL_TX, WL_UART_DBG, XTAL_32K_CLK, XTALOSC_REF_CLK_32K
net class BLE: +1V8_WIFI, +1V8_WIFI_OSO, +3V3, +3V3_HDR, +3V3_WIFI, +VIN_4V2, ANT1, ANT1_FEED, ANT1_LC, ANT1_SMP, ANT2, ANT2_FEED, ANT2_LC, ANT2_SMP, BT_AUD_CLK, BT_AUD_FSYNC, BT_AUD_IN, BT_AUD_OUT, BT_CSPI_RXD, BT_CSPI_TXC, BT_CSPI_TXD, BT_CSPI_TXFS, BT_EN, BT_EN_D, BT_EN_LED, BT_EN_R, BT_HCI_CTS, BT_HCI_RTS, BT_HCI_RX, BT_HCI_TX, BT_UART_CTS, BT_UART_DBG, BT_UART_RTS, BT_UART_RXD, BT_UART_TXD, CPU_WIFI_LS_EN, CPU_WL_EN, CSPI2_RXD, CSPI2_TXC, CSPI2_TXD, CSPI2_TXFS, EN_1V8WIFI, FB_1V8WIFI, GND, PWR_1V8WIFI, SLOW_CLK, SW_1V8WIFI, UART3_CTS, UART3_RTS, UART3_RXD, UART3_TXD, UART5_CTS, UART5_RTS, UART5_RXD, UART5_TXD, WIFI_CLK, WIFI_CMD, WIFI_DATA0, WIFI_DATA1, WIFI_DATA2, WIFI_DATA3, WIFI_EXT_32K_CLK, WIFI_IRQ, WL_EN, WL_EN_D, WL_EN_LED, WL_IRQ, WL_RX, WL_SDIO_CLK, WL_SDIO_CMD, WL_SDIO_D0, WL_SDIO_D1, WL_SDIO_D2, WL_SDIO_D3, WL_TX, WL_UART_DBG, XTAL_32K_CLK, XTALOSC_REF_CLK_32K
net class WL_SDIO: +1V8_WIFI, +1V8_WIFI_OSO, +3V3, +3V3_HDR, +3V3_WIFI, +VIN_4V2, ANT1, ANT1_FEED, ANT1_LC, ANT1_SMP, ANT2, ANT2_FEED, ANT2_LC, ANT2_SMP, BT_AUD_CLK, BT_AUD_FSYNC, BT_AUD_IN, BT_AUD_OUT, BT_CSPI_RXD, BT_CSPI_TXC, BT_CSPI_TXD, BT_CSPI_TXFS, BT_EN, BT_EN_D, BT_EN_LED, BT_EN_R, BT_HCI_CTS, BT_HCI_RTS, BT_HCI_RX, BT_HCI_TX, BT_UART_CTS, BT_UART_DBG, BT_UART_RTS, BT_UART_RXD, BT_UART_TXD, CPU_WIFI_LS_EN, CPU_WL_EN, CSPI2_RXD, CSPI2_TXC, CSPI2_TXD, CSPI2_TXFS, EN_1V8WIFI, FB_1V8WIFI, GND, PWR_1V8WIFI, SLOW_CLK, SW_1V8WIFI, UART3_CTS, UART3_RTS, UART3_RXD, UART3_TXD, UART5_CTS, UART5_RTS, UART5_RXD, UART5_TXD, WIFI_CLK, WIFI_CMD, WIFI_DATA0, WIFI_DATA1, WIFI_DATA2, WIFI_DATA3, WIFI_EXT_32K_CLK, WIFI_IRQ, WL_EN, WL_EN_D, WL_EN_LED, WL_IRQ, WL_RX, WL_SDIO_CLK, WL_SDIO_CMD, WL_SDIO_D0, WL_SDIO_D1, WL_SDIO_D2, WL_SDIO_D3, WL_TX, WL_UART_DBG, XTAL_32K_CLK, XTALOSC_REF_CLK_32K
net class SD1_WIFI: +1V8_WIFI, +1V8_WIFI_OSO, +3V3, +3V3_HDR, +3V3_WIFI, +VIN_4V2, ANT1, ANT1_FEED, ANT1_LC, ANT1_SMP, ANT2, ANT2_FEED, ANT2_LC, ANT2_SMP, BT_AUD_CLK, BT_AUD_FSYNC, BT_AUD_IN, BT_AUD_OUT, BT_CSPI_RXD, BT_CSPI_TXC, BT_CSPI_TXD, BT_CSPI_TXFS, BT_EN, BT_EN_D, BT_EN_LED, BT_EN_R, BT_HCI_CTS, BT_HCI_RTS, BT_HCI_RX, BT_HCI_TX, BT_UART_CTS, BT_UART_DBG, BT_UART_RTS, BT_UART_RXD, BT_UART_TXD, CPU_WIFI_LS_EN, CPU_WL_EN, CSPI2_RXD, CSPI2_TXC, CSPI2_TXD, CSPI2_TXFS, EN_1V8WIFI, FB_1V8WIFI, GND, PWR_1V8WIFI, SLOW_CLK, SW_1V8WIFI, UART3_CTS, UART3_RTS, UART3_RXD, UART3_TXD, UART5_CTS, UART5_RTS, UART5_RXD, UART5_TXD, WIFI_CLK, WIFI_CMD, WIFI_DATA0, WIFI_DATA1, WIFI_DATA2, WIFI_DATA3, WIFI_EXT_32K_CLK, WIFI_IRQ, WL_EN, WL_EN_D, WL_EN_LED, WL_IRQ, WL_RX, WL_SDIO_CLK, WL_SDIO_CMD, WL_SDIO_D0, WL_SDIO_D1, WL_SDIO_D2, WL_SDIO_D3, WL_TX, WL_UART_DBG, XTAL_32K_CLK, XTALOSC_REF_CLK_32K
net class SD2_WIFI: +1V8_WIFI, +1V8_WIFI_OSO, +3V3, +3V3_HDR, +3V3_WIFI, +VIN_4V2, ANT1, ANT1_FEED, ANT1_LC, ANT1_SMP, ANT2, ANT2_FEED, ANT2_LC, ANT2_SMP, BT_AUD_CLK, BT_AUD_FSYNC, BT_AUD_IN, BT_AUD_OUT, BT_CSPI_RXD, BT_CSPI_TXC, BT_CSPI_TXD, BT_CSPI_TXFS, BT_EN, BT_EN_D, BT_EN_LED, BT_EN_R, BT_HCI_CTS, BT_HCI_RTS, BT_HCI_RX, BT_HCI_TX, BT_UART_CTS, BT_UART_DBG, BT_UART_RTS, BT_UART_RXD, BT_UART_TXD, CPU_WIFI_LS_EN, CPU_WL_EN, CSPI2_RXD, CSPI2_TXC, CSPI2_TXD, CSPI2_TXFS, EN_1V8WIFI, FB_1V8WIFI, GND, PWR_1V8WIFI, SLOW_CLK, SW_1V8WIFI, UART3_CTS, UART3_RTS, UART3_RXD, UART3_TXD, UART5_CTS, UART5_RTS, UART5_RXD, UART5_TXD, WIFI_CLK, WIFI_CMD, WIFI_DATA0, WIFI_DATA1, WIFI_DATA2, WIFI_DATA3, WIFI_EXT_32K_CLK, WIFI_IRQ, WL_EN, WL_EN_D, WL_EN_LED, WL_IRQ, WL_RX, WL_SDIO_CLK, WL_SDIO_CMD, WL_SDIO_D0, WL_SDIO_D1, WL_SDIO_D2, WL_SDIO_D3, WL_TX, WL_UART_DBG, XTAL_32K_CLK, XTALOSC_REF_CLK_32K
net class UART5: +1V8_WIFI, +1V8_WIFI_OSO, +3V3, +3V3_HDR, +3V3_WIFI, +VIN_4V2, ANT1, ANT1_FEED, ANT1_LC, ANT1_SMP, ANT2, ANT2_FEED, ANT2_LC, ANT2_SMP, BT_AUD_CLK, BT_AUD_FSYNC, BT_AUD_IN, BT_AUD_OUT, BT_CSPI_RXD, BT_CSPI_TXC, BT_CSPI_TXD, BT_CSPI_TXFS, BT_EN, BT_EN_D, BT_EN_LED, BT_EN_R, BT_HCI_CTS, BT_HCI_RTS, BT_HCI_RX, BT_HCI_TX, BT_UART_CTS, BT_UART_DBG, BT_UART_RTS, BT_UART_RXD, BT_UART_TXD, CPU_WIFI_LS_EN, CPU_WL_EN, CSPI2_RXD, CSPI2_TXC, CSPI2_TXD, CSPI2_TXFS, EN_1V8WIFI, FB_1V8WIFI, GND, PWR_1V8WIFI, SLOW_CLK, SW_1V8WIFI, UART3_CTS, UART3_RTS, UART3_RXD, UART3_TXD, UART5_CTS, UART5_RTS, UART5_RXD, UART5_TXD, WIFI_CLK, WIFI_CMD, WIFI_DATA0, WIFI_DATA1, WIFI_DATA2, WIFI_DATA3, WIFI_EXT_32K_CLK, WIFI_IRQ, WL_EN, WL_EN_D, WL_EN_LED, WL_IRQ, WL_RX, WL_SDIO_CLK, WL_SDIO_CMD, WL_SDIO_D0, WL_SDIO_D1, WL_SDIO_D2, WL_SDIO_D3, WL_TX, WL_UART_DBG, XTAL_32K_CLK, XTALOSC_REF_CLK_32K
net class ANTENNA: +1V8_WIFI, +1V8_WIFI_OSO, +3V3, +3V3_HDR, +3V3_WIFI, +VIN_4V2, ANT1, ANT1_FEED, ANT1_LC, ANT1_SMP, ANT2, ANT2_FEED, ANT2_LC, ANT2_SMP, BT_AUD_CLK, BT_AUD_FSYNC, BT_AUD_IN, BT_AUD_OUT, BT_CSPI_RXD, BT_CSPI_TXC, BT_CSPI_TXD, BT_CSPI_TXFS, BT_EN, BT_EN_D, BT_EN_LED, BT_EN_R, BT_HCI_CTS, BT_HCI_RTS, BT_HCI_RX, BT_HCI_TX, BT_UART_CTS, BT_UART_DBG, BT_UART_RTS, BT_UART_RXD, BT_UART_TXD, CPU_WIFI_LS_EN, CPU_WL_EN, CSPI2_RXD, CSPI2_TXC, CSPI2_TXD, CSPI2_TXFS, EN_1V8WIFI, FB_1V8WIFI, GND, PWR_1V8WIFI, SLOW_CLK, SW_1V8WIFI, UART3_CTS, UART3_RTS, UART3_RXD, UART3_TXD, UART5_CTS, UART5_RTS, UART5_RXD, UART5_TXD, WIFI_CLK, WIFI_CMD, WIFI_DATA0, WIFI_DATA1, WIFI_DATA2, WIFI_DATA3, WIFI_EXT_32K_CLK, WIFI_IRQ, WL_EN, WL_EN_D, WL_EN_LED, WL_IRQ, WL_RX, WL_SDIO_CLK, WL_SDIO_CMD, WL_SDIO_D0, WL_SDIO_D1, WL_SDIO_D2, WL_SDIO_D3, WL_TX, WL_UART_DBG, XTAL_32K_CLK, XTALOSC_REF_CLK_32K

### Notes on the sheet
- No DRC Flag
- BLE,  WIFI
- 1.8V WIFI Supply
- No Driving Source
- DESIGN NOTE:
  Datasheet pins out to testpoints for debug only.
- (near TP57) Wi-Fi, Bluetooth Module
- DESIGN NOTE:
  TI Reserved for future use.
  NC if not used
- (near R516) Indicator LED's
- IO and Output Pins
- Level Shifters
- DESIGN NOTE: http://processors.wiki.ti.com/index.php/WL18xx_First_Time_Getting_Started_Guide_(IMX6)#Hardware
- SD Port Select
- DESIGN NOTE:
  Fit only one resistor per one signal according to the picture below.
- SD1
- WIFI
- SD2
- LAYOUT NOTE:
  1) The RF trace antenna feed must be as short as possible beyond the ground reference. At this point, the trace starts to radiate.
  2) RF trace bends must be gradual with an approximate maximum bend of 45 degrees with trace mitered. RF
  traces must not have sharp corners.
  3) RF traces must have via stitching on the ground plane beside the RF trace on both sides.
  4) RF traces must have constant impedance (microstrip transmission line).
  5) For best results, the RF trace ground layer must be the ground layer immediately below the RF trace. The ground layer must be solid.
  6) There must be no traces or ground under the antenna section.
  7) The distance between ANT1 and ANT2 must be greater
  than half the wavelength (62.5 mm at 2.4 GHz).
- SD1 to WIFI
- 0R
- SD2 to WIFI
- DESIGN NOTE:
  Host must provide PU using a 10-K resistor for all non-CLK SDIO signals.Host must provide PU using a 10-K resistor for all non-CLK SDIO signals.
- Antennas
- (in symbol 2N7002BKW,115) D; G; S